# EasyEDA Pro project ProPrj_Xros rev.5_2026-01-20.epro

# Schematic Project Xros rev.5
Board Name: PCB2; Create Date: 2026-01-11; Page Name: Sheet_1; Project Name: Xros rev.5; Schematic Name: Project Xros rev.5; Update Date: 2026-01-20; Add into BOM: yes; Company: Bad Company; Convert to PCB: yes; Date: 2021-11-16; Draw By: Miraculix200; REV: 1.1; Sheet: 1/1; spicePre: .
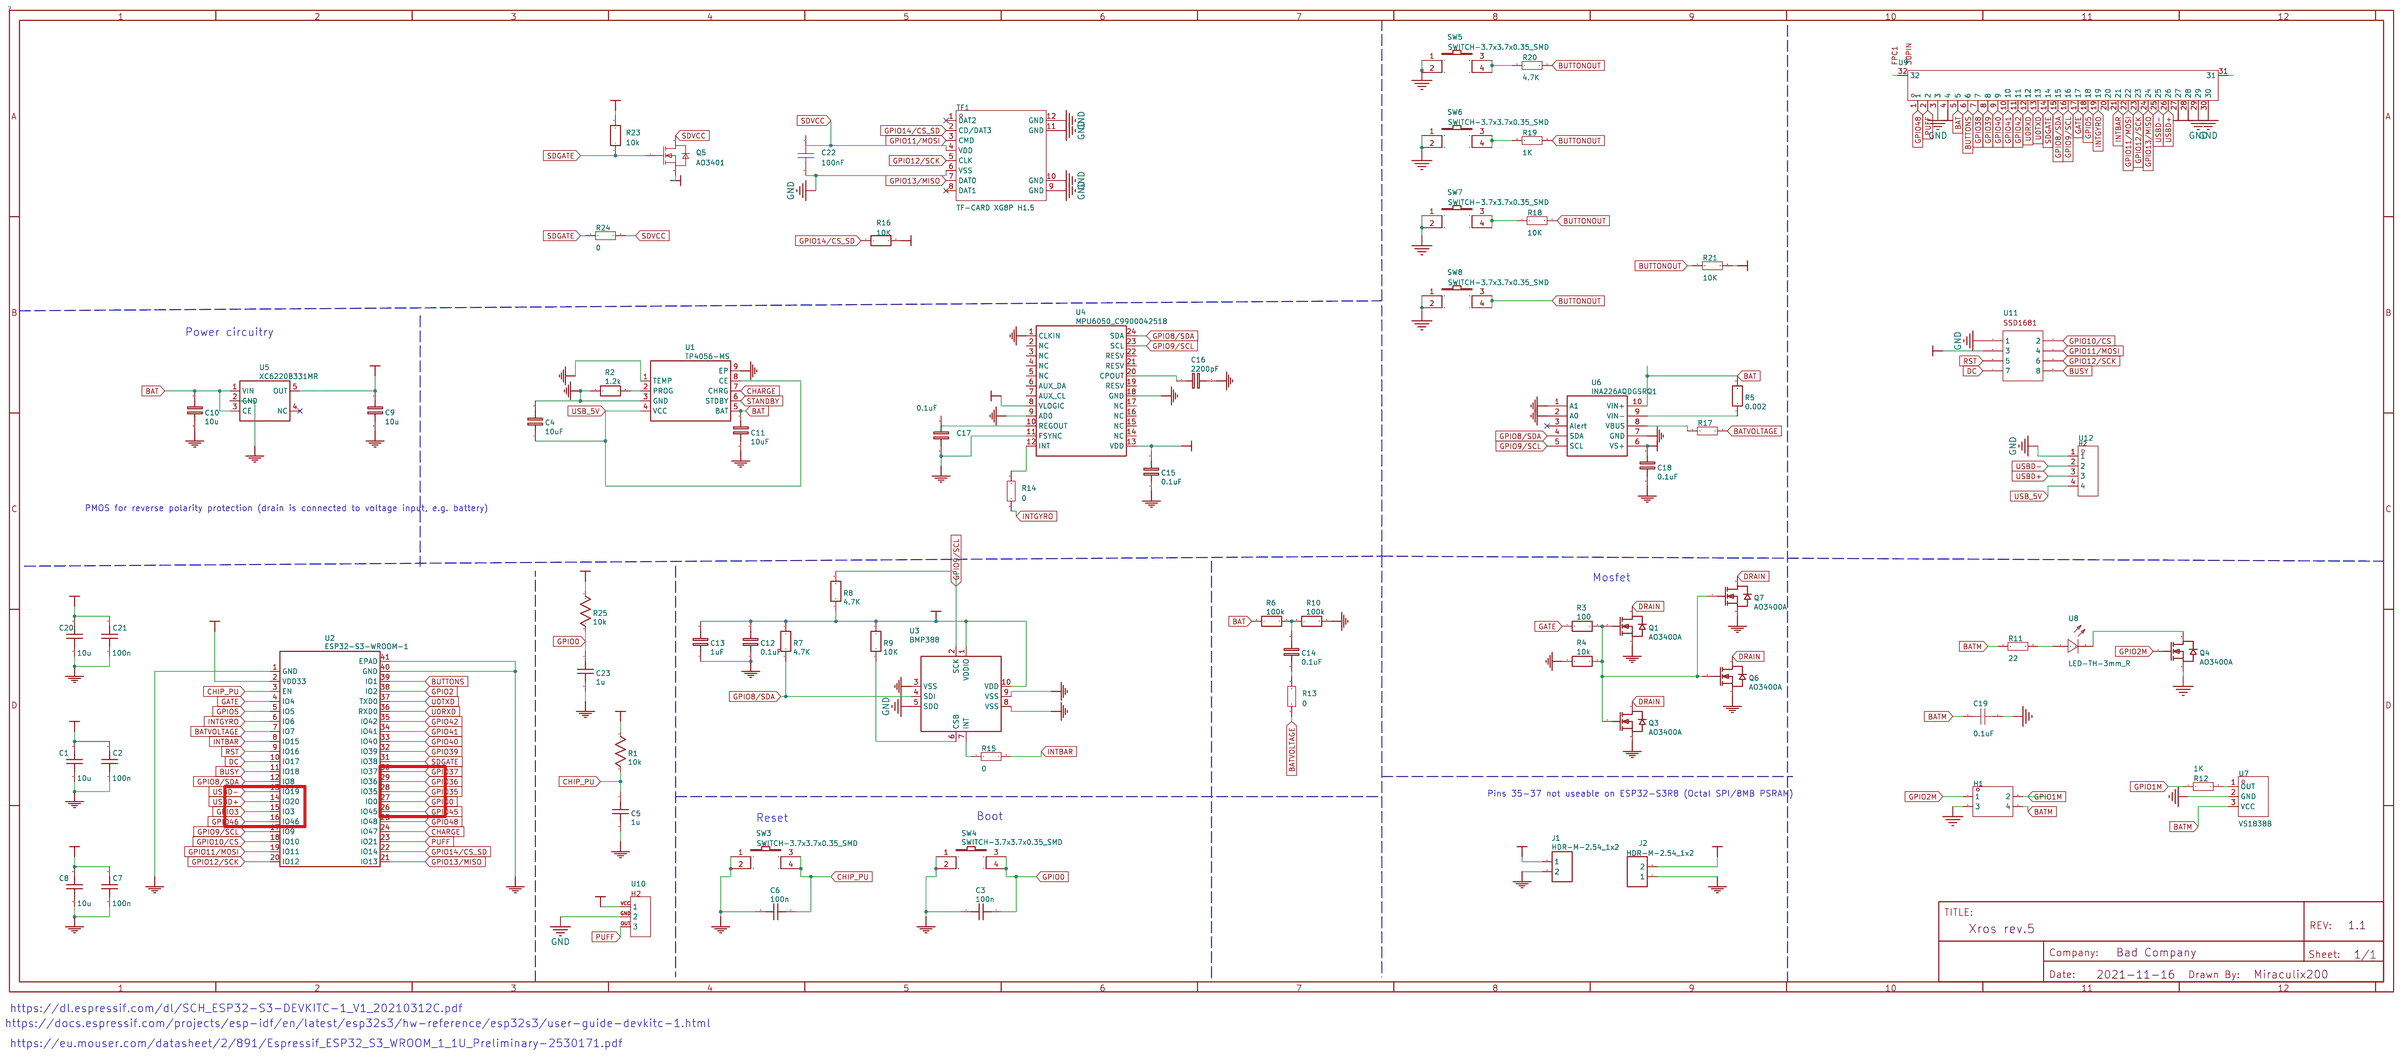
[diagram p0: schematic sheet]

## Parts
C1  10u  [C0805]
C2  100n  [C0805]
C3  100n  [C0805]
C4  10uF  [C0805]
C5  1u  [C0805]
C6  100n  [C0805]
C7  100n  [C0805]
C8  10u  [C0805]
C9  10u  [C0805]
C10  10u  [C0805]
C11  10uF  [C0805]
C12  0.1uF  [C0805]
C13  1uF  [C0805]
C14  0.1uF  [C0805]
C15  0.1uF  [C0805]
C16  2200pF  [C0805]
C17  0.1uF  [C0805]
C18  0.1uF  [C0805]
C19  0.1uF  [C0805]
C20  10u  [C0805]
C21  100n  [C0805]
C22  100nF  [C0805]
C23  1u  [C0805]
H1  -  [HDR-TH_4P-P2.54-V-F-R2-C2-S2.54]
J1  HDR-M-2.54_1x2  [HDR-M-2.54_1X2]
J2  HDR-M-2.54_1x2  [HDR-M-2.54_1X2]
Q1  AO3400A  [SOT-23-3_L2.9-W1.3-P1.90-LS2.4-BR]
Q3  AO3400A  [SOT-23-3_L2.9-W1.3-P1.90-LS2.4-BR]
Q4  AO3400A  [SOT-23-3_L2.9-W1.3-P1.90-LS2.4-BR]
Q5  AO3401  [SOT-23-3_L2.9-W1.4-P1.90-LS2.5-BR]
Q6  AO3400A  [SOT-23-3_L2.9-W1.3-P1.90-LS2.4-BR]
Q7  AO3400A  [SOT-23-3_L2.9-W1.3-P1.90-LS2.4-BR]
R1  10k  [R0805]
R2  1.2k  [R0805]
R3  100  [R0805]
R4  10k  [R0805]
R5  0.002  [R2512]
R6  100k  [R0805]
R7  4.7K  [R0805]
R8  4.7K  [R0805]
R9  10K  [R0805]
R10  100k  [R0805]
R11  22  [R0805]
R12  1K  [R0805]
R13  0  [0402]
R14  0  [0402]
R15  0  [0402]
R16  10K  [R0805]
R17  0  [0402]
R18  10K  [R0805]
R19  1K  [R0805]
R20  4.7K  [R0805]
R21  10K  [R0805]
R23  10k  [R0805]
R24  0  [0402]
R25  10k  [R0805]
SW3  SWITCH-3.7x3.7x0.35_SMD  [SW-SMD_4P-L3.7-W3.7-P2.75-LS3.7]
SW4  SWITCH-3.7x3.7x0.35_SMD  [SW-SMD_4P-L3.7-W3.7-P2.75-LS3.7]
SW5  SWITCH-3.7x3.7x0.35_SMD  [SW-SMD_4P-L3.7-W3.7-P2.75-LS3.7]
SW6  SWITCH-3.7x3.7x0.35_SMD  [SW-SMD_4P-L3.7-W3.7-P2.75-LS3.7]
SW7  SWITCH-3.7x3.7x0.35_SMD  [SW-SMD_4P-L3.7-W3.7-P2.75-LS3.7]
SW8  SWITCH-3.7x3.7x0.35_SMD  [SW-SMD_4P-L3.7-W3.7-P2.75-LS3.7]
TF1  TF-CARD XG8P H1.5  [TF-SMD_TF-CARD-XG8P-H1.5]
U1  TP4056-MS  [SOP-8_L4.9-W3.9-P1.27-LS6.0-TL-EP]
U2  ESP32-S3-WROOM-1  [ESP32-S3-WROOM-1]
U3  BMP388  [SENSORM-SMD_BMP388]
U4  MPU6050_C9900042518  [QFN-24_L4.0-W4.0-P0.50-BL]
U5  XC6220B331MR  [SOT-23-5_L2.9-W1.6-P0.95-LS2.8-BR]
U6  INA226AQDGSRQ1  [VSSOP-10_L3.0-W3.0-P0.50-LS4.9-BL]
U7  VS1838B  [OPTO-TH_VS1838B]
U8  LED-TH-3mm_R  [LED-TH_BD5.4-P2.54-FD_RED]
U9  -  [26PIN-FDD]
U10  -  [Puff sensor]
U11  -  [HDR-TH_8P-P0.6]
U12  -  [USB-CONNECTOR-4-PIN]

## Library data of the parts
C1 C8 C20 = 10u: nameAlias: Value(F); Contributor: LCEDA_Lib; spicePre: C; spiceSymbolName: C_0201_US
C2 C3 C6 C7 C21 = 100n: nameAlias: Value(F); Contributor: LCEDA_Lib; spicePre: C; spiceSymbolName: C_0201_US
C4 C11 = 10uF: nameAlias: Value(F); Contributor: LCEDA_Lib; spicePre: C; spiceSymbolName: C_0603_EU
C5 C23 = 1u: nameAlias: Value(F); Contributor: LCEDA_Lib; spicePre: C; spiceSymbolName: C_0201_US
C9 C10 = 10u: Supplier Part: C15849; Supplier: LCSC; Manufacturer Part: CL10A105KB8NNNC; Manufacturer: SAMSUNG; nameAlias: Value(F); Contributor: LCEDA_Lib; spicePre: C; spiceSymbolName: C_0603_EU
C12 C14 C15 C17 C18 = 0.1uF: nameAlias: Value(F); Contributor: LCEDA_Lib; spicePre: C; spiceSymbolName: C_0603_EU
C13 = 1uF: nameAlias: Value(F); Contributor: LCEDA_Lib; spicePre: C; spiceSymbolName: C_0603_EU
C16 = 2200pF: nameAlias: Value(F); Contributor: LCEDA_Lib; spicePre: C; spiceSymbolName: C_0603_EU
C19 C22 = CAP_0201: Supplier Footprint: 0201
H1 = HDR-F_2.54_2x2: Supplier Footprint: Through
J1 J2 = HDR-M-2.54_1x2: Supplier Part: C124375; Supplier: LCSC; Contributor: LCEDA_Lib; spicePre: J
Q1 Q3 Q4 Q6 Q7 = AO3400A: Supplier: LCSC; Manufacturer: AOS; Supplier Part: C20917; JLCPCB Part Class: Basic Part; spicePre: Q
Q5 = AO3401_C53261043: Supplier Part: C53261043; Manufacturer: GMIC(绿微); Supplier Footprint: SOT-23; JLCPCB Part Class: Extended Part; Datasheet: https://item.szlcsc.com/datasheet/AO3401/56319604.html; Supplier: LCSC
R1 R25 = 10k: nameAlias: Value(Ω); Contributor: LCEDA_Lib; spicePre: R; spiceSymbolName: R_0201_US
R2 R16 = 1.2k: nameAlias: Value(Ω); Contributor: LCEDA_Lib; spicePre: R; spiceSymbolName: R_0603_EU
R3 = 100: nameAlias: Value(Ω); Contributor: LCEDA_Lib; spicePre: R; spiceSymbolName: R_0603_EU
R4 R7 R23 = 10k: nameAlias: Value(Ω); Contributor: LCEDA_Lib; spicePre: R; spiceSymbolName: R_0603_EU
R5 = 0.002: nameAlias: Value(Ω); Contributor: LCEDA_Lib; spicePre: R; spiceSymbolName: R_0603_EU
R6 R10 = 100k: nameAlias: Value(Ω); Contributor: LCEDA_Lib; spicePre: R; spiceSymbolName: R_0603_EU
R8 R9 = 10K: nameAlias: Value(Ω); Contributor: LCEDA_Lib; spicePre: R; spiceSymbolName: R_0603_EU
R11-R15 R17 R24 = Res_0603: Supplier Footprint: 0603
R18-R21 = Res_0805: Supplier Footprint: 0805
SW3-SW8 = SWITCH-3.7x3.7x0.35_SMD: EasyEDA: E19636; Supplier Part: E19636; Supplier: EasyEDA; Manufacturer: BBJ; Contributor: Conrad Lagorio; spicePre: S
TF1 = TF-CARD XG8P H1.5: Card Connection Mode:Hinged Lid Card Type:MicroSD Card (TF Card) Connector Type:Connector and Ejector Additional Card Detection Pins:- Supplementary Features:- Height Above Board:1.5mm Operating Temperature:-25℃~+90℃ Operating Temperature:-25℃~+90℃; LCSC Part Name: 翻盖式 MicroSD卡(TF卡) 卡座; Supplier Part: C7529392; Manufacturer: SHOU HAN(首韩); Supplier Footprint: SMD; JLCPCB Part Class: Extended Part; Datasheet: https://item.szlcsc.com/datasheet/TF-CARD%2520XG8P%2520H1.5/8629779.html; Supplier: LCSC; Card Connection Mode: Hinged Lid; Card Type: MicroSD Card (TF Card); Connector Type: Connector and Ejector; Height Above Board: 1.5mm; Operating Temperature: -25℃~+90℃
U1 = TP4056-MS: Supplier: LCSC; Supplier Part: C7473158; Manufacturer: MSKSEMI(美森科); JLCPCB Part Class: Extended Part; Contributor: lcsc; spicePre: U
U2 = ESP32-S3-WROOM-1: Manufacturer: Espressif Systems; Contributor: max30012540; spicePre: U
U3 = BMP388: Supplier: LCSC; Supplier Part: C779278; Manufacturer: Bosch(博世); JLCPCB Part Class: Extended Part; Contributor: LCSC; spicePre: U
U4 = MPU6050_C9900042518: Supplier: LCSC; Supplier Part: C9900042518; Manufacturer: null; Manufacturer Part: MPU6050; Contributor: lcsc; spicePre: U
U5 = XC6220B331MR: Supplier: LCSC; Supplier Part: C3040644; Manufacturer: TECH PUBLIC(台舟); JLCPCB Part Class: Extended Part; Contributor: lcsc; spicePre: U
U6 = INA226AQDGSRQ1: Supplier: LCSC; Supplier Part: C2653835; Manufacturer: TI(德州仪器); JLCPCB Part Class: Extended Part; Contributor: lcsc; spicePre: U
U7 = VS1838B: Supplier Part: C9900002107; Supplier Footprint: TH-3_4.8X6.7X2.54P; JLCPCB Part Class: Extended Part; Supplier: LCSC
U8 = LED-TH-3mm_R: Supplier Part: C9900003210; Supplier Footprint: LED-TH_BD3.0_RED; JLCPCB Part Class: Extended Part; Supplier: LCSC
U9 = 26PIN-dff
U10 = Puff sensor
U11 = HDR-TH_8P-P0.6
U12 = USB-CONNECTOR-OUT

## Nets
3V3: C1.2 C2.2 C7.2 C8.2 C9.1 C12.2 C13.2 C15.2 C18.1 C20.2 C21.2 J1.1 Q5.2(S) R1.1 R7.2 R8.1 R9.2 R16.2 R23.2 R25.1 U2.2(VDD33) U3.1(VDDIO) U3.10(VDD) U4.8(VLOGIC) U4.13(VDD) U5.5(OUT) U6.6(VS+) U9.4 U9.27 U9.28 U10.VCC(1) U11.3
3V3_BUT: R21.2
GND: C1.1 C2.1 C3.2 C4.2 C5.2 C6.2 C7.1 C8.1 C9.2 C10.2 C11.2 C12.1 C13.1 C15.1 C16.2 C17.2 C18.2 C20.1 C21.1 C22.2 C23.2 J1.2 J2.1 Q1.2(S) Q3.2(S) Q6.2(S) Q7.2(S) R2.1 R4.1 R10.2 SW3.1 SW3.2 SW4.1 SW4.2 TF1.6(VSS) TF1.9(GND) TF1.10(GND) TF1.11(GND) TF1.12(GND) U1.1(TEMP) U1.3(GND) U1.9(EP) U2.1(GND) U2.40(GND) U2.41(EPAD) U3.3(VSS) U3.5(SDO) U3.8(VSS) U3.9(VSS) U4.1(CLKIN) U4.9(AD0) U4.11(FSYNC) U4.18(GND) U5.2(GND) U6.1(A1) U6.2(A0) U6.7(GND) U9.3 U9.29 U9.30 U10.GND(2) U11.1 U12.1
GND_BUT: SW5.1 SW5.2 SW6.1 SW6.2 SW7.1 SW7.2 SW8.1 SW8.2
GNDM: C19.1 H1.3 Q4.2(S) U7.2(GND)
VIN: J2.2
BAT: C10.1 C11.1 R5.2 R6.1 U1.5(BAT) U5.1(VIN) U5.3(CE) U6.10(VIN+) U9.5
BATM: C19.2 H1.4 R11.1 U7.3(VCC)
BATVOLTAGE: R13.1 R17.2 U2.7(IO7)
BUSY: U2.11(IO18) U11.8
BUTTONOUT: R18.2 R19.2 R20.2 R21.1 SW8.3 SW8.4
BUTTONS: U2.39(IO1) U9.6
CHARGE: U1.7(CHRG) U2.24(IO47)
CHIP_PU: C5.1 C6.1 R1.2 SW3.3 SW3.4 U2.3(EN)
DC: U2.10(IO17) U11.7
DRAIN: Q1.3(D) Q3.3(D) Q6.3(D) Q7.3(D)
GATE: R3.1 U2.4(IO4) U9.17
GPIO0: C3.1 C23.1 R25.2 SW4.3 SW4.4 U2.27(IO0)
GPIO1M: H1.2 R12.1
GPIO2: U2.38(IO2)
GPIO2M: H1.1 Q4.1(G)
GPIO3: U2.15(IO3)
GPIO5: U2.5(IO5) U9.18
GPIO8/SDA: R7.1 U2.12(IO8) U3.4(SDI) U4.24(SDA) U6.4(SDA) U9.15
GPIO9/SCL: R8.2 U2.17(IO9) U3.2(SCK) U4.23(SCL) U6.5(SCL) U9.16
GPIO10/CS: U2.18(IO10) U11.2
GPIO11/MOSI: TF1.3(CMD) U2.19(IO11) U9.22 U11.4
GPIO12/SCK: TF1.5(CLK) U2.20(IO12) U9.23 U11.6
GPIO13/MISO: TF1.7(DAT0) U2.21(IO13) U9.24
GPIO14/CS_SD: R16.1 TF1.2(CD/DAT3) U2.22(IO14)
GPIO35: U2.28(IO35)
GPIO36: U2.29(IO36)
GPIO37: U2.30(IO37)
GPIO38: U9.7
GPIO39: U2.32(IO39) U9.8
GPIO40: U2.33(IO40) U9.9
GPIO41: U2.34(IO41) U9.10
GPIO42: U2.35(IO42) U9.11
GPIO45: U2.26(IO45)
GPIO46: U2.16(IO46)
GPIO48: U2.25(IO48) U9.1
INTBAR: R15.2 U2.8(IO15) U9.21
INTGYRO: R14.2 U2.6(IO6) U9.19
PUFF: U2.23(IO21) U9.2 U10.OUT(3)
RST: U2.9(IO16) U11.5
SDGATE: Q5.1(G) R23.1 R24.1 U2.31(IO38) U9.14
SDVCC: C22.1 Q5.3(D) R24.2 TF1.4(VDD)
STANDBY: U1.6(STDBY)
U0RXD: U2.36(RXD0) U9.12
U0TXD: U2.37(TXD0) U9.13
USB_5V: C4.1 U1.4(VCC) U1.8(CE) U12.4
USBD+: U2.14(IO20) U9.26 U12.3
USBD-: U2.13(IO19) U9.25 U12.2
$1N56: R2.2 U1.2(PROG)
$1N60: Q1.1(G) Q3.1(G) Q6.1(G) Q7.1(G) R3.2 R4.2
$1N63: C14.2 R6.2 R10.1
$1N73: R9.1 U3.6(CSB)
$1N78: C16.1 U4.20(CPOUT)
$1N83: R5.1 U6.9(VIN-)
$1N6278: C14.1 R13.2
$1N14594: R15.1 U3.7(INT)
$1N23852: R14.1 U4.12(INT)
$1N23899: R17.1 U6.8(VBUS)
$1N25750: R20.1 SW5.3 SW5.4
$1N25760: R19.1 SW6.3 SW6.4
$1N25770: R18.1 SW7.3 SW7.4
Net-(Q4-3): Q4.3(D) U8.2
Net-(R11-2): R11.2 U8.1
Net-(R12-2): R12.2 U7.1(OUT)

Not connected (* = marked no-connect by the designer): C17 1; TF1 1(DAT2)* 8(DAT1)*; U4 2(NC) 3(NC) 4(NC) 5(NC) 6(AUX_DA) 7(AUX_CL) 10(REGOUT) 14(NC) 15(NC) 16(NC) 17(NC) 19(RESV) 21(RESV) 22(RESV); U5 4(NC)*; U6 3(Alert)*; U9 20 31 32

## Notes on the sheet
- Power circuitry
- PMOS for reverse polarity protection (drain is connected to voltage input, e.g. battery)
- Mosfet
- Pins 35-37 not useable on ESP32-S3R8 (Octal SPI/8MB PSRAM)
- Reset
- Boot
- https://dl.espressif.com/dl/SCH_ESP32-S3-DEVKITC-1_V1_20210312C.pdf
- https://docs.espressif.com/projects/esp-idf/en/latest/esp32s3/hw-reference/esp32s3/user-guide-devkitc-1.html
- https://eu.mouser.com/datasheet/2/891/Espressif_ESP32_S3_WROOM_1_1U_Preliminary-2530171.pdf

# Board PCB1
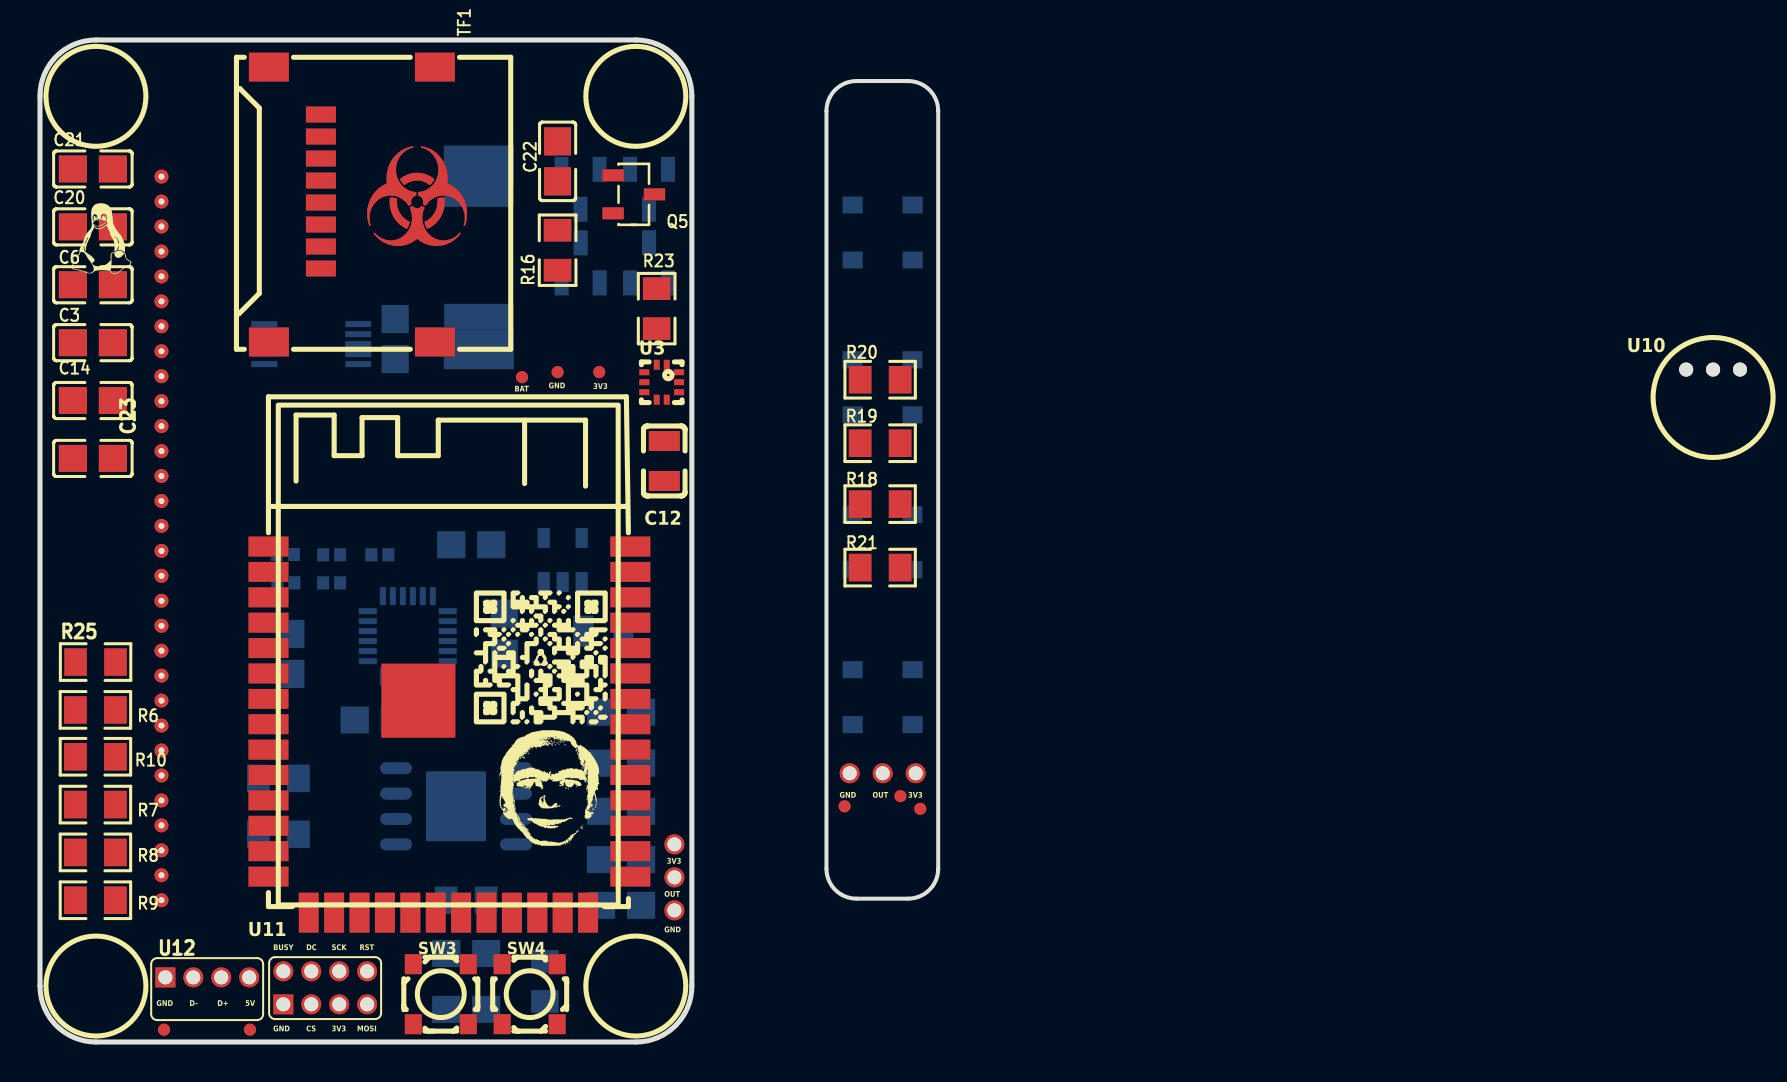
[diagram p1: board, top side]
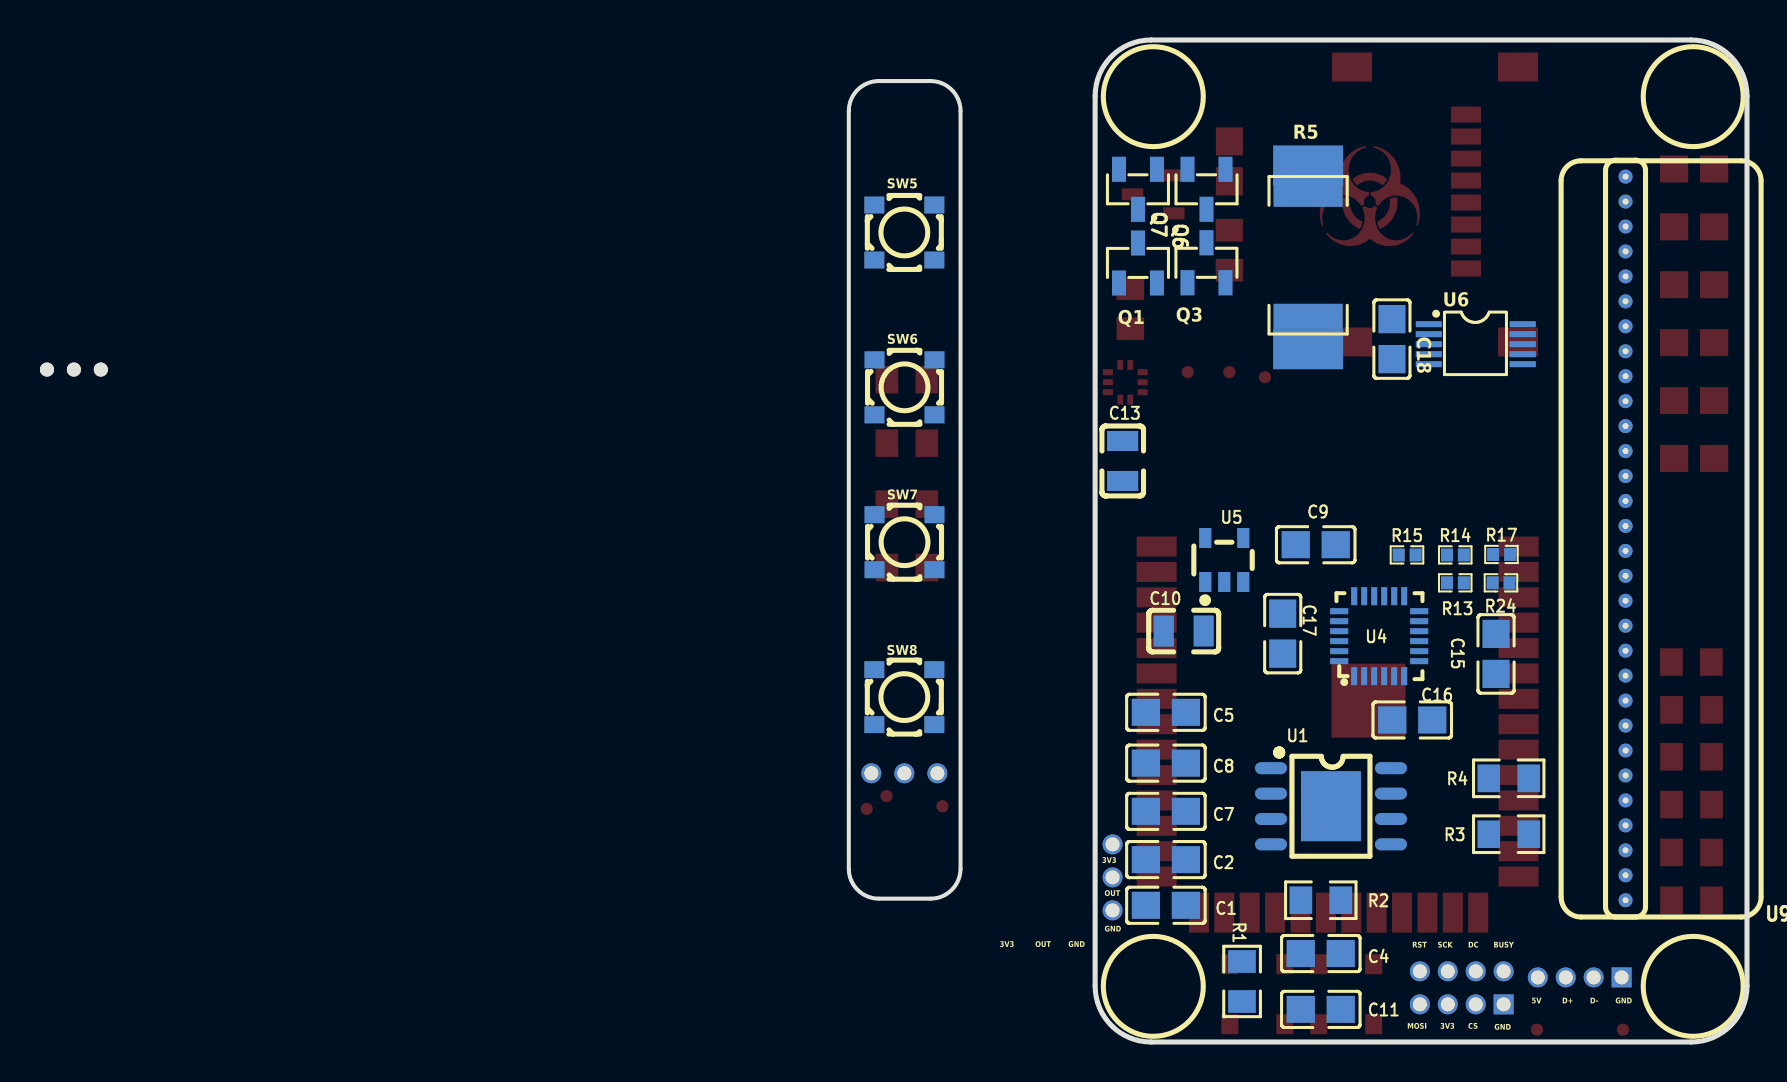
[diagram p2: board, bottom side, seen from below]

Outline 44.92 x 50.12 mm; copper layers: Top Layer, Inner1, Inner2, Inner3, Inner4, Inner5, Inner6, Bottom Layer. Coordinates in mm from the lower left corner of the outline.
Outline path: 0,47.32 0,2.8 arc(0.82,0.82) 2.8,0 29.8,0 arc(31.78,0.82) 32.6,2.8 32.6,47.32 arc(31.78,49.3) 29.8,50.12 2.8,50.12 arc(0.82,49.3) 0,47.32 ; 39.33,46.56 39.33,8.67 arc(39.77,7.61) 40.83,7.17 43.42,7.17 arc(44.48,7.61) 44.92,8.67 44.92,46.56 arc(44.48,47.63) 43.42,48.06 40.83,48.06 arc(39.77,47.63) 39.33,46.56
Stack: Top Layer 0.035mm Outer layer thickness 1oz / Dielectric1 0.1164mm 2116 RC54% 4.9mil / Inner1 0.0152mm Inner layer thickness / Dielectric2 0.3mm 0.3mm H/HOZ No copper / Inner2 0.0152mm Inner layer thickness / Dielectric3 0.0764mm 1080 RC67% 3.3mil / Dielectric4 0.0764mm 1080 RC67% 3.3mil / Inner3 0.0152mm Inner layer thickness / Dielectric5 0.3mm 0.3mm H/HOZ No copper / Inner4 0.0152mm Inner layer thickness / Dielectric6 0.0764mm 1080 RC67% 3.3mil / Dielectric7 0.0764mm 1080 RC67% 3.3mil / Inner5 0.0152mm Inner layer thickness / Dielectric8 0.3mm 0.3mm H/HOZ No copper / Inner6 0.0152mm Inner layer thickness / Dielectric9 0.1164mm 2116 RC54% 4.9mil / Bottom Layer 0.035mm Outer layer thickness 1oz

## Design rules (mm)
template: Custom Config
spacing copperThickness1oz (default): track to track 0.102, other pairs 0.152 to 0.3
spacing copperThickness2oz: track to track 0.203, other pairs 0.152 to 0.3
track width copperThickness1oz (default): min 0.127, default 0.15, max 2.54
track width copperThickness2oz: min 0.1, default 0.15, max 2.54
differential pair differentialPair (default): width min 0.127, default 0.254, max 2.54; gap min 0.152, default 0.152
via viaSize (default): diameter min 0.5, default 0.61, max 10; hole min 0.3, default 0.305, max 6.3

## Placement (name value [footprint] x y rotation side)
C1  10u  [C0805#2]  29.06 6.84 180 bottom
C2  100n  [C0805#2]  29.06 9.12 180 bottom
C3  100n  [C0805#2]  2.64 34.98 180 top
C4  10uF  [C0805#2]  21.31 4.42 180 bottom
C5  1u  [C0805#2]  29.06 16.49 0 bottom
C6  100n  [C0805#2]  2.64 37.88 180 top
C7  100n  [C0805#2]  29.06 11.54 180 bottom
C8  10u  [C0805#2]  29.06 13.95 180 bottom
C9  10u  [C0805#2]  21.57 24.87 0 bottom
C10  10u  [C0805]  28.17 20.55 180 bottom
C11  10uF  [C0805#2]  21.31 1.63 180 bottom
C12  0.1uF  [C0805]  31.22 29.06 90 top
C13  1uF  [C0805]  31.22 29.06 90 bottom
C14  0.1uF  [C0805#2]  2.64 32.09 180 top
C15  0.1uF  [C0805#2]  12.55 19.41 270 bottom
C16  2200pF  [C0805#2]  16.74 16.11 180 bottom
C17  0.1uF  [C0805#2]  23.22 20.43 270 bottom
C18  0.1uF  [C0805#2]  17.76 35.16 90 bottom
C20  10u  [C0805#2]  2.64 40.77 0 top
C21  100n  [C0805#2]  2.64 43.67 0 top
C22  100nF  [C0805#2]  25.89 44.05 90 top
C23  1u  [C0805#2]  2.64 29.19 0 top
NOREF  -  [Pad_e83]  10.5 0.62 0 top
NOREF#2  -  [Pad_e81]  6.2 0.61 0 top
NOREF#3  -  [Pad_e5643]  42.14 13.44 0 top
NOREF#4  -  [Pad_e5684]  21.95 43.84 90 top
NOREF#5  -  [Pad_e87]  27.97 33.51 0 top
NOREF#6  -  [Pad_e18]  43.03 12.3 0 top
NOREF#7  -  [Pad_e5644]  43.79 13.44 0 top
NOREF#8  -  [Pad_e86]  25.89 33.51 0 top
NOREF#9  -  [Pad_e84]  40.24 11.79 0 top
NOREF#10  -  [Pad_e85]  44.02 11.66 0 top
NOREF#11  -  [Pad_e5683]  21.95 34.65 90 top
NOREF#12  -  [Pad_e5638]  40.49 13.44 0 top
NOREF#13  -  [Pad_e5650]  31.73 6.58 90 top
NOREF#14  -  [Pad_e27]  24.11 33.25 0 top
NOREF#15  -  [Pad_e5648]  31.73 9.89 90 top
NOREF#16  -  [Pad_e5649]  31.73 8.23 90 top
Q1  AO3400A  [SOT-23-3_L2.9-W1.3-P1.90-LS2.4-BR]  30.46 38.97 270 bottom
Q3  AO3400A  [SOT-23-3_L2.9-W1.3-P1.90-LS2.4-BR]  27.03 38.97 270 bottom
Q5  AO3401  [SOT-23-3_L2.9-W1.4-P1.90-LS2.5-BR]  29.7 42.4 180 top
Q6  AO3400A  [SOT-23-3_L2.9-W1.3-P1.90-LS2.4-BR]  27.03 42.65 90 bottom
Q7  AO3400A  [SOT-23-3_L2.9-W1.3-P1.90-LS2.4-BR]  30.46 42.65 90 bottom
R1  10k  [R0805]  25.25 3.03 90 bottom
R2  1.2k  [R0805]  21.31 7.09 180 bottom
R3  100  [R0805]  11.92 10.39 180 bottom
R4  10k  [R0805]  11.92 13.19 180 bottom
R5  0.002  [R2512]  21.95 39.35 270 bottom
R6  100k  [R0805]  2.77 16.61 180 top
R7  4.7K  [R0805]  2.77 11.88 0 top
R8  4.7K  [R0805]  2.77 9.48 0 top
R9  10K  [R0805]  2.77 7.09 0 top
R10  100k  [R0805]  2.77 14.27 180 top
R13  0  [0402]  14.58 22.97 180 bottom
R14  0  [0402]  14.58 24.36 180 bottom
R15  0  [0402]  17 24.36 180 bottom
R16  10K  [R0805]  25.89 39.6 90 top
R17  0  [0402]  12.27 24.39 180 bottom
R18  10K  [R0805]  42.02 26.9 0 top
R19  1K  [R0805]  42.02 29.95 0 top
R20  4.7K  [R0805]  42.02 33.13 0 top
R21  10K  [R0805]  42.02 23.73 180 top
R23  10k  [R0805]  30.84 36.68 270 top
R24  0  [0402]  12.3 22.97 180 bottom
R25  10k  [R0805]  2.78 19 0 top
SW3  SWITCH-3.7x3.7x0.35_SMD  [SW-SMD_4P-L3.7-W3.7-P2.75-LS3.7]  20.04 2.39 270 top
SW4  SWITCH-3.7x3.7x0.35_SMD  [SW-SMD_4P-L3.7-W3.7-P2.75-LS3.7]  24.49 2.39 90 top
SW5  SWITCH-3.7x3.7x0.35_SMD  [SW-SMD_4P-L3.7-W3.7-P2.75-LS3.7]  42.14 40.49 180 bottom
SW6  SWITCH-3.7x3.7x0.35_SMD  [SW-SMD_4P-L3.7-W3.7-P2.75-LS3.7]  42.13 32.75 180 bottom
SW7  SWITCH-3.7x3.7x0.35_SMD  [SW-SMD_4P-L3.7-W3.7-P2.75-LS3.7]  42.13 25 180 bottom
SW8  SWITCH-3.7x3.7x0.35_SMD  [SW-SMD_4P-L3.7-W3.7-P2.75-LS3.7]  42.14 17.25 180 bottom
TF1  TF-CARD XG8P H1.5  [TF-SMD_TF-CARD-XG8P-H1.5]  15.6 41.89 270 top
U1  TP4056-MS  [SOP-8_L4.9-W3.9-P1.27-LS6.0-TL-EP]  20.81 11.79 180 bottom
U2  -  [ESP32-S3-WROOM-1]  20.42 15.47 0 top
U3  BMP388  [SENSORM-SMD_BMP388]  31.09 33 0 top
U4  MPU6050_C9900042518  [QFN-24_L4.0-W4.0-P0.50-BL]  18.39 20.3 180 bottom
U5  XC6220B331MR  [SOT-23-5_L2.9-W1.6-P0.95-LS2.8-BR]  26.14 24.11 270 bottom
U6  INA226AQDGSRQ1  [VSSOP-10_L3.0-W3.0-P0.50-LS4.9-BL]  13.57 34.91 270 bottom
U9  -  [26PIN-FDD]  4.8 22.97 0 bottom
U10  -  [Puff sensor]  83.67 32.24 0 top
U11  -  [HDR-TH_8P-P0.6]  13.82 1.63 0 top
U12  -  [USB-CONNECTOR-4-PIN]  8.36 2.65 0 top

## Footprints (pads in the part's own frame, mm; a bottom-side part is the same pattern mirrored in y, then rotated)
26PIN-FDD
  round 0.7 hole 0.3: 1(1.27,15.875) 2(1.27,14.627) 3(1.27,13.379) 4(1.27,12.13) 5(1.27,10.883) 6(1.27,9.634) 7(1.27,8.386) 8(1.27,7.138) 9(1.27,5.89) 10(1.27,4.642) 11(1.27,3.394) 12(1.27,2.146) 13(1.27,0.898) 14(1.27,-0.35) 15(1.27,-1.599) 16(1.27,-2.846) 17(1.27,-4.095) 18(1.27,-5.343) 19(1.27,-6.591) 20(1.27,-7.839) 21(1.27,-9.087) 22(1.27,-10.335) 23(1.27,-11.584) 24(1.27,-12.832) 25(1.27,-14.079) 26(1.27,-15.328) 27(1.27,-16.576) 28(1.27,-17.824) 29(1.27,-19.072) 30(1.27,-20.32)
0402
  rect 0.6x0.65 smd: 1(-0.424,0) 2(0.424,0)
C0805
  rect 1x1.55 smd: 1(-1,0) 2(1,0)
C0805#2
  rect 1.41x1.35 smd: 1(-1,0) 2(1,0)
ESP32-S3-WROOM-1
  rect 2x1 smd: 1(-9,9.31) 2(-9,8.04) 3(-9,6.77) 4(-9,5.5) 5(-9,4.23) 6(-9,2.96) 7(-9,1.69) 8(-9,0.42) 9(-9,-0.85) 10(-9,-2.12) 11(-9,-3.39) 12(-9,-4.66) 13(-9,-5.93) 14(-9,-7.2) 27(9.1,-7.2) 28(9.1,-5.93) 29(9.1,-4.66) 30(9.1,-3.39) 31(9.1,-2.12) 32(9.1,-0.85) 33(9.1,0.42) 34(9.1,1.69) 35(9.1,2.96) 36(9.1,4.23) 37(9.1,5.5) 38(9.1,6.77) 39(9.1,8.04) 40(9.1,9.31)
  rect 1x2 smd: 15(-6.985,-9.005) 16(-5.715,-9.005) 17(-4.445,-9.005) 18(-3.175,-9.005) 19(-1.905,-9.005) 20(-0.635,-9.005) 21(0.635,-9.005) 22(1.905,-9.005) 23(3.175,-9.005) 24(4.445,-9.005) 25(5.715,-9.005) 26(6.985,-9.005)
  rect 3.7x3.7 smd: 41(-1.5,1.6)
HDR-TH_8P-P0.6
  rect 1x1 hole 0.7: 1(-1.651,0.254)
  round 1 hole 0.7: 2(-0.254,0.254) 3(1.143,0.254) 4(2.54,0.254) 5(2.54,1.905) 6(1.143,1.905) 7(-0.254,1.905) 8(-1.651,1.905)
Pad_e18
  round 0.61 smd: TP4(0,0)
Pad_e27
  round 0.61 smd: TP6(0,0)
Pad_e81
  round 0.61 smd: TP1(0,0)
Pad_e83
  round 0.61 smd: TP2(0,0)
Pad_e84
  round 0.61 smd: TP3(0,0)
Pad_e85
  round 0.61 smd: TP4(0,0)
Pad_e86
  round 0.61 smd: TP5(0,0)
Pad_e87
  round 0.61 smd: TP6(0,0)
Pad_e5638
  round 1 hole 0.7: 1(0,0)
Pad_e5643
  round 1 hole 0.7: 1(0,0)
Pad_e5644
  round 1 hole 0.7: 1(0,0)
Pad_e5648
  round 1 hole 0.7: 1(0,0)
Pad_e5649
  round 1 hole 0.7: 1(0,0)
Pad_e5650
  round 1 hole 0.7: 1(0,0)
Pad_e5683
  rect 2x3.5 smd far side: 1(0,0)
Pad_e5684
  rect 2x3.5 smd far side: 1(0,0)
Puff sensor
  round 0.7 hole 0.914x0.5: GND(0,1.397) OUT(-1.346,1.397) VCC(1.346,1.397)
QFN-24_L4.0-W4.0-P0.50-BL
  rect 0.3x0.9 smd: 1(-1.25,-2) 2(-0.75,-2) 3(-0.25,-2) 4(0.25,-2) 5(0.75,-2) 6(1.25,-2) 13(1.25,2) 14(0.75,2) 15(0.25,2) 16(-0.25,2) 17(-0.75,2) 18(-1.25,2)
  rect 0.9x0.3 smd: 7(2,-1.25) 8(2,-0.75) 9(2,-0.25) 10(2,0.25) 11(2,0.75) 12(2,1.25) 19(-2,1.25) 20(-2,0.75) 21(-2,0.25) 22(-2,-0.25) 23(-2,-0.75) 24(-2,-1.25)
R0805
  rect 1.133x1.377 smd: 1(-1,0) 2(1,0)
R2512
  rect 1.282x3.456 smd: 1(-3.067,0) 2(3.067,0)
SENSORM-SMD_BMP388
  rect 0.3x0.5 smd: 1(0.25,0.871) 2(-0.25,0.871) 6(-0.25,-0.871) 7(0.25,-0.871)
  rect 0.5x0.3 smd: 3(-0.869,0.5) 4(-0.869,0) 5(-0.869,-0.5) 8(0.869,-0.5) 9(0.869,0) 10(0.869,0.5)
SOP-8_L4.9-W3.9-P1.27-LS6.0-TL-EP
  oval 1.6x0.6 smd: 1(-3,1.905) 2(-3,0.635) 3(-3,-0.635) 4(-3,-1.905) 5(3,-1.905) 6(3,-0.635) 7(3,0.635) 8(3,1.905)
  rect 3x3.5 smd: 9(0,0)
SOT-23-3_L2.9-W1.3-P1.90-LS2.4-BR
  rect 1.25x0.7 smd: 1(1,-0.95) 2(1,0.95) 3(-1,0)
SOT-23-3_L2.9-W1.4-P1.90-LS2.5-BR
  rect 1.07x0.6 smd: 1(1.035,-0.95) 2(1.035,0.95) 3(-1.035,0)
SOT-23-5_L2.9-W1.6-P0.95-LS2.8-BR
  rect 1x0.6 smd: 1(1.1,-0.95) 2(1.1,0) 3(1.1,0.95) 4(-1.1,0.95) 5(-1.1,-0.95)
SW-SMD_4P-L3.7-W3.7-P2.75-LS3.7
  rect 1x0.85 smd: 1(-1.5,1.375) 2(1.5,1.375) 3(-1.5,-1.375) 4(1.5,-1.375)
TF-SMD_TF-CARD-XG8P-H1.5
  rect 0.8x1.5 smd: 1(3.2,-1.55) 2(2.1,-1.55) 3(1,-1.55) 4(-0.1,-1.55) 5(-1.2,-1.55) 6(-2.3,-1.55) 7(-3.4,-1.55) 8(-4.5,-1.55)
  rect 1.45x2 smd: 9(-6.875,4.15) 10(-6.875,-4.15) 11(6.875,-4.15) 12(6.875,4.15)
USB-CONNECTOR-4-PIN
  rect 1x1 hole 0.7: 1(-2.089,0.585)
  round 1 hole 0.7: 2(-0.692,0.585) 3(0.705,0.585) 4(2.102,0.585)
VSSOP-10_L3.0-W3.0-P0.50-LS4.9-BL
  rect 0.3x1.3 smd: 1(-1,-2.35) 2(-0.5,-2.35) 3(-0.001,-2.35) 4(0.5,-2.35) 5(1,-2.35) 6(1,2.35) 7(0.5,2.35) 8(0,2.35) 9(-0.5,2.35) 10(-1,2.35)

## Nets
As in the schematic, except:
3V3: C1.2 C2.2 C7.2 C8.2 C9.1 C12.2 C13.2 C15.2 C18.1 C20.2 C21.2 NOREF#5.TP6 NOREF#15.1 Q5.2 R1.1 R7.2 R8.1 R9.2 R16.2 R23.2 R25.1 U2.2 U3.1 U3.10 U4.8 U4.13 U5.5 U6.6 U9.4 U9.27 U9.28 U10.VCC U11.3
3V3_BUT: NOREF#7.1 NOREF#10.TP4 R21.2
GND: C1.1 C2.1 C3.2 C4.2 C5.2 C6.2 C7.1 C8.1 C9.2 C10.2 C11.2 C12.1 C13.1 C15.1 C16.2 C17.2 C18.2 C20.1 C21.1 C22.2 C23.2 NOREF#8.TP5 NOREF#13.1 Q1.2 Q3.2 Q6.2 Q7.2 R2.1 R4.1 R10.2 SW3.1 SW3.2 SW4.1 SW4.2 TF1.6 TF1.9 TF1.10 TF1.11 TF1.12 U1.1 U1.3 U1.9 U2.1 U2.40 U2.41 U3.3 U3.5 U3.8 U3.9 U4.1 U4.9 U4.11 U4.18 U5.2 U6.1 U6.2 U6.7 U9.3 U9.29 U9.30 U10.GND U11.1 U12.1
GND_BUT: NOREF#9.TP3 NOREF#12.1 SW5.1 SW5.2 SW6.1 SW6.2 SW7.1 SW7.2 SW8.1 SW8.2
BAT: C10.1 C11.1 NOREF#11.1 NOREF#14.TP6 R5.2 R6.1 U1.5 U5.1 U5.3 U6.10 U9.5
BUTTONOUT: NOREF#3.1 NOREF#6.TP4 R18.2 R19.2 R20.2 R21.1 SW8.3 SW8.4
BUTTONS: NOREF#16.1 U2.39 U9.6
$1N83: NOREF#4.1 R5.1 U6.9

Pads without a net: C17 1; NOREF TP2; NOREF#2 TP1; TF1 1 8; U4 2 3 4 5 6 7 14 15 16 17 19 21 22; U5 4; U6 3; U9 20

Small or netless copper shapes (teardrops, artwork), in the pictures only: 6 on Top Layer

## Text on the board
Bottom Silkscreen Layer: OUT | GND | 3V3 | D- | D+ | 5V | BUSY | DC | CS | SCK | RST | MOSI
Top Silkscreen Layer: GND | D- | D+ | 5V | BUSY | DC | CS | SCK | 3V3 | MOSI | RST | BAT | OUT
